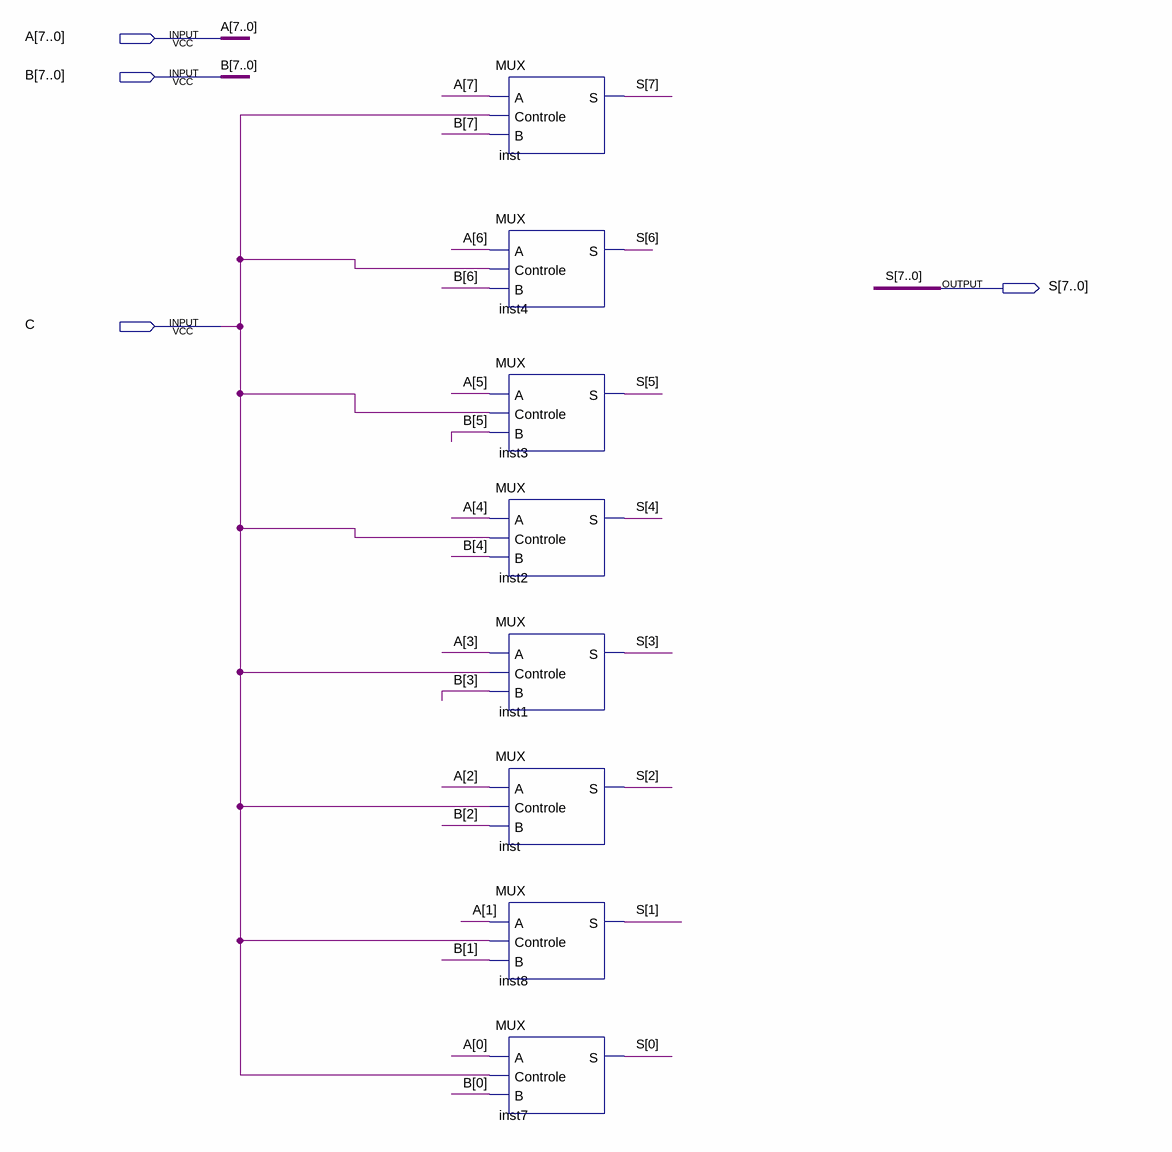
[diagram p0: schematic sheet]
// Quartus schematic MUX8BIT.bdf as structural Verilog: 8 symbols, 4 pins
module MUX8BIT (
  input  [7:0] A,
  input  [7:0] B,
  input  C,
  output [7:0] S
);

  MUX inst (.A(A[7]), .Controle(C), .B(B[7]), .S(S[7]));
  MUX inst4 (.A(A[6]), .Controle(C), .B(B[6]), .S(S[6]));
  MUX inst3 (.A(A[5]), .Controle(C), .B(B[5]), .S(S[5]));
  MUX inst2 (.A(A[4]), .Controle(C), .B(B[4]), .S(S[4]));
  MUX inst1 (.A(A[3]), .Controle(C), .B(B[3]), .S(S[3]));
  MUX inst_dup2 (.A(A[2]), .Controle(C), .B(B[2]), .S(S[2]));
  MUX inst8 (.A(A[1]), .Controle(C), .B(B[1]), .S(S[1]));
  MUX inst7 (.A(A[0]), .Controle(C), .B(B[0]), .S(S[0]));
endmodule
